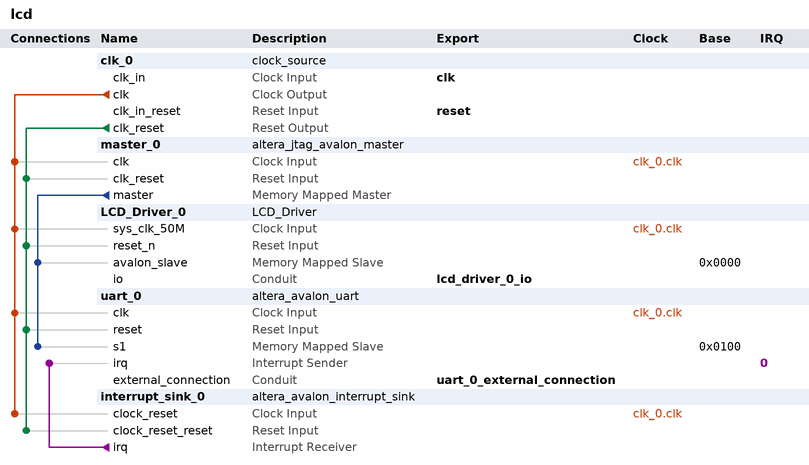
[diagram p0: system contents]
# Platform Designer (Qsys) system lcd, Cyclone II EP2C8Q208C8
# Parameters at their usual value, and those the tool derives, are not listed.
package require -exact qsys 13.0
create_system lcd
set_project_property DEVICE_FAMILY {Cyclone II}
set_project_property DEVICE EP2C8Q208C8

add_instance clk_0 clock_source 13.0
set_instance_parameter_value clk_0 clockFrequency 50000000

add_instance master_0 altera_jtag_avalon_master 13.0

add_instance LCD_Driver_0 LCD_Driver 1.0

add_instance uart_0 altera_avalon_uart 13.0.1.99.2
set_instance_parameter_value uart_0 baud 115200
set_instance_parameter_value uart_0 dataBits 8
set_instance_parameter_value uart_0 fixedBaud true
set_instance_parameter_value uart_0 parity NONE
set_instance_parameter_value uart_0 stopBits 1

add_instance interrupt_sink_0 altera_avalon_interrupt_sink 13.0
set_instance_parameter_value interrupt_sink_0 ASSERT_HIGH_IRQ 1
set_instance_parameter_value interrupt_sink_0 AV_IRQ_W 1
set_instance_parameter_value interrupt_sink_0 ASYNCHRONOUS_INTERRUPT 0
set_instance_parameter_value interrupt_sink_0 VHDL_ID 0

# connections
add_connection clk_0.clk interrupt_sink_0.clock_reset clock
add_connection clk_0.clk LCD_Driver_0.sys_clk_50M clock
add_connection clk_0.clk master_0.clk clock
add_connection clk_0.clk uart_0.clk clock
add_connection clk_0.clk_reset interrupt_sink_0.clock_reset_reset reset
add_connection clk_0.clk_reset LCD_Driver_0.reset_n reset
add_connection clk_0.clk_reset master_0.clk_reset reset
add_connection clk_0.clk_reset uart_0.reset reset
add_connection master_0.master LCD_Driver_0.avalon_slave avalon
set_connection_parameter_value master_0.master/LCD_Driver_0.avalon_slave baseAddress 0x0000
add_connection master_0.master uart_0.s1 avalon
set_connection_parameter_value master_0.master/uart_0.s1 baseAddress 0x0100
add_connection interrupt_sink_0.irq uart_0.irq interrupt
set_connection_parameter_value interrupt_sink_0.irq/uart_0.irq irqNumber 0

# exported interfaces
add_interface clk clock sink
set_interface_property clk EXPORT_OF clk_0.clk_in
add_interface reset reset sink
set_interface_property reset EXPORT_OF clk_0.clk_in_reset
add_interface lcd_driver_0_io conduit end
set_interface_property lcd_driver_0_io EXPORT_OF LCD_Driver_0.io
add_interface uart_0_external_connection conduit end
set_interface_property uart_0_external_connection EXPORT_OF uart_0.external_connection

set_interconnect_requirement {$system} qsys_mm.clockCrossingAdapter HANDSHAKE
set_interconnect_requirement {$system} qsys_mm.maxAdditionalLatency 1

save_system lcd.qsys
